# EAGLE design Apo Board 2017_PB (EAGLE 7.6.0)
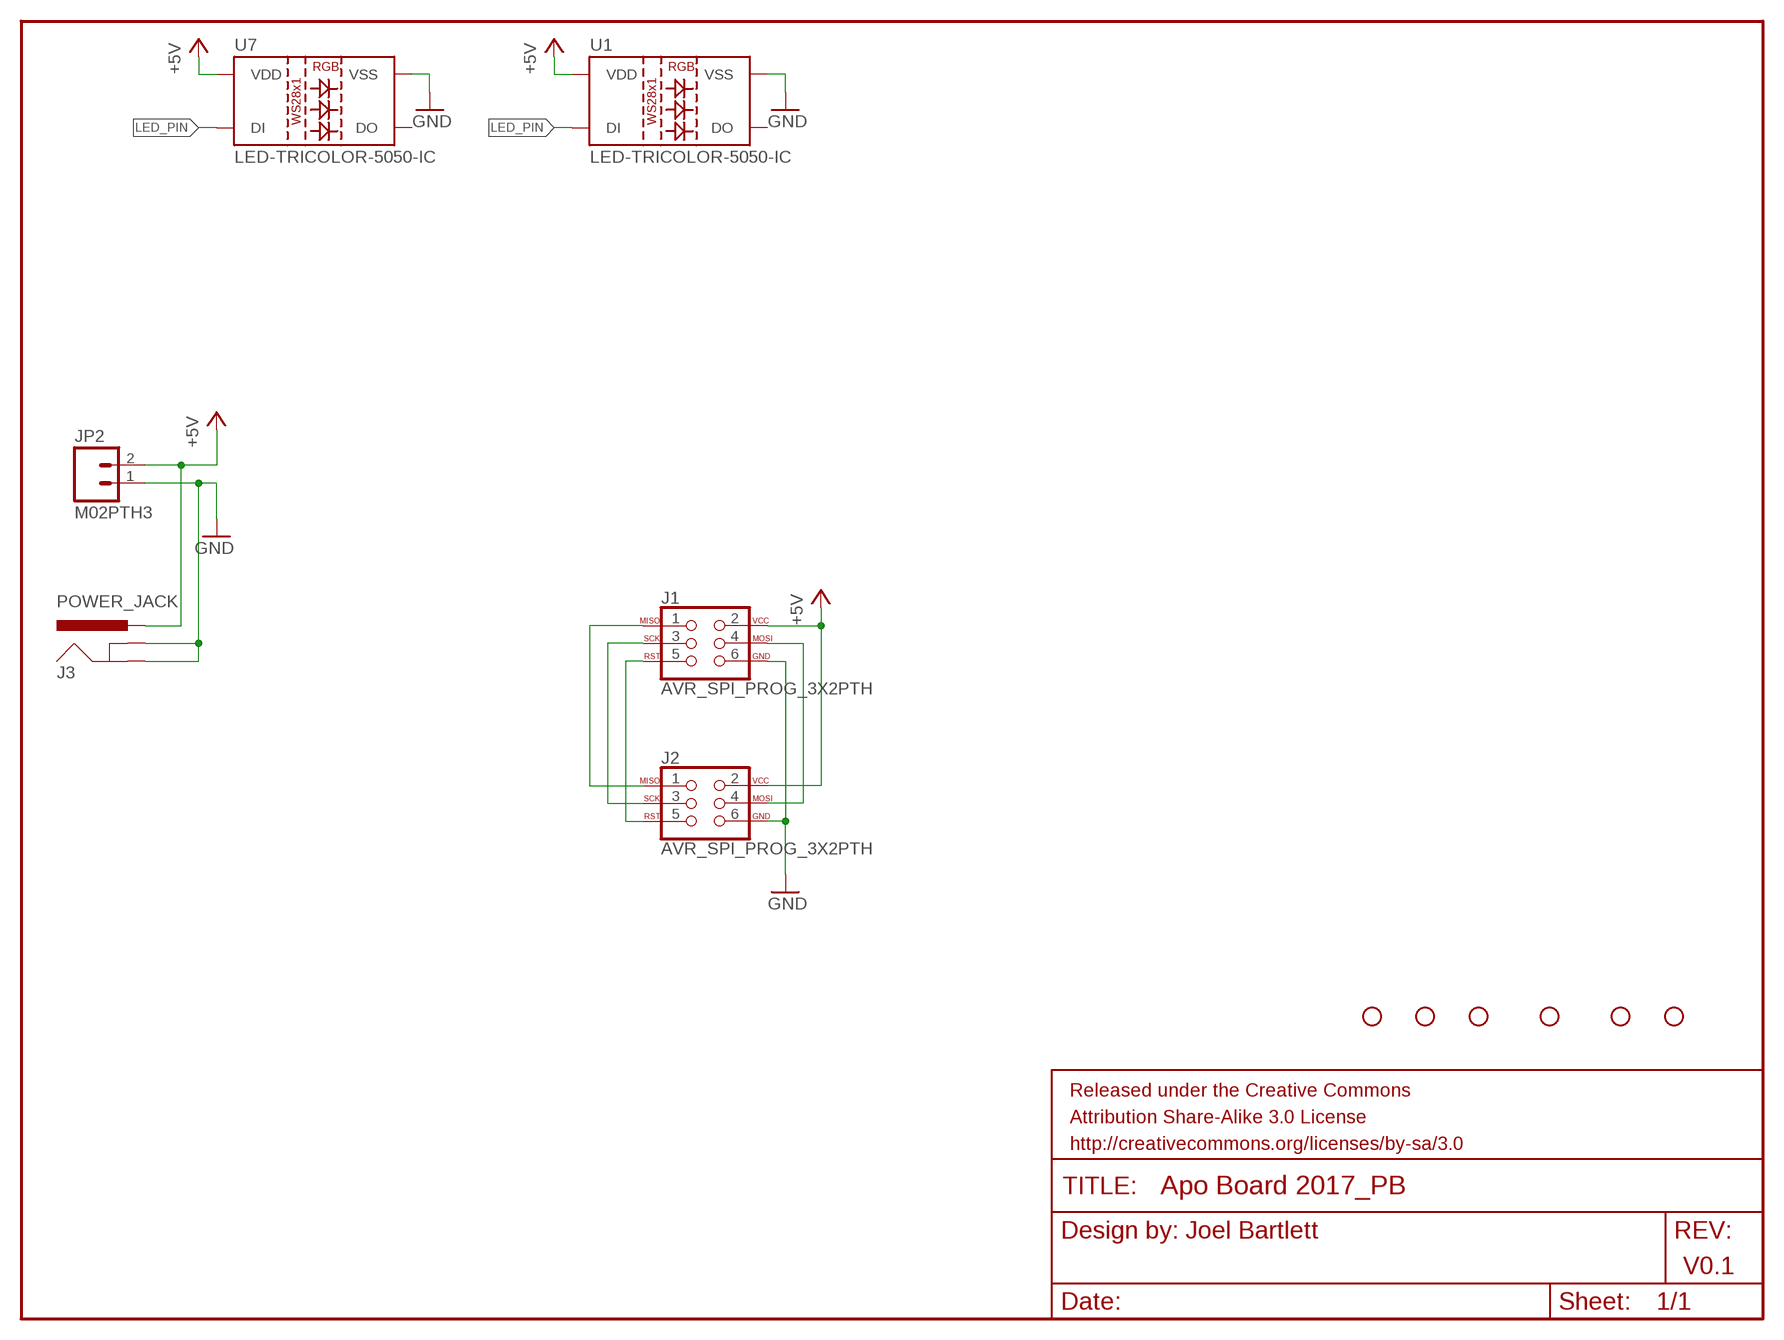
[diagram p0: schematic, sheet 1]

## Parts
FRAME1  FRAME-LETTER  [CREATIVE_COMMONS]
H1  STAND-OFF  [STAND-OFF]
H2  STAND-OFF  [STAND-OFF]
H3  STAND-OFF  [STAND-OFF]
H4  STAND-OFF  [STAND-OFF]
H5  STAND-OFF  [STAND-OFF]
H6  STAND-OFF  [STAND-OFF]
J1  AVR_SPI_PROG_3X2PTH  [2X3]
J2  AVR_SPI_PROG_3X2PTH  [2X3]
J3  POWER_JACK  [POWER_JACK_PTH]
JP2  M02PTH3  [1X02_LONGPADS]
U1  LED-TRICOLOR-5050-IC  [LED-RGB-THRU]
U7  LED-TRICOLOR-5050-IC  [LED-RGB-THRU]

## Nets
+5V: J1.2 J2.2 J3.PWR JP2.2 U1.2(VDD) U7.2(VDD)
GND: J1.6 J2.6 J3.GND J3.GNDBREAK JP2.1 U1.3(VSS) U7.3(VSS)
LED_PIN: U1.1(DI) U7.1(DI)
N$2: J1.4 J2.4
N$4: J1.5 J2.5
N$5: J1.3 J2.3
N$6: J1.1 J2.1
Unconnected: U1.4(DO) U7.4(DO)

## Notes on the sheet
- Joel Bartlett
- V0.1

## Library data of the parts
FRAME1 = SparkFun-Aesthetics:FRAME-LETTER: Schematic Frame Standard 8.5x11 US Letter frame
H1-H6 = SparkFun-Hardware:STAND-OFF: Stand Off Drill holes for mechanically mounting via screws, standoffs, etc. Note: Use the keepout ring to avoid running the screw head into surrounding components. Variant Overviews STAND-OFF - Mechanical footprint for a #4 phillips button head screw. STAND-OFF-TIGHT - Mechanical footprint for a #4 phillips button head screw, Example SparkFun Products Screw - Phillips Head (1/4", 4-40, 10 pack) <https://www.sparkfun.com/products/10453> (PRT-10453) Screw - Phillips Head (1/2", 4-40, 10 pack) <https://www.sparkfun.com/products/10452> (PRT-10452) Screw - Phillips Head (3/4", 4-40, 10 pack) <https://www.sparkfun.com/products/10451> (PRT-10451) Screw - Phillips Head (1", 4-40, 10 pack) <https://www.sparkfun.com/products/10450> (PRT-10450)
J1 J2 = SparkFun-Connectors:AVR_SPI_PROG_3X2: AVR ISP 6 Pin This is the reduced ISP connector for AVR programming. Common on Arduino. This footprint will take up less PCB space and can be used with a 10-pin to 6-pin adapter such as SKU: BOB-08508 **Special note about "TEST_POINT" package. The stop mask is on the top side, so if you want your programming test points to be on the bottom of your board, make sure to place this package on the bottom side of the board. This also ensure that the orientation to program from the bottom side will be correct. SparkFun Products: SparkFun ISP Pogo Adapter <https://www.sparkfun.com/products/11591> - NS Tiny AVR Programmer <https://www.sparkfun.com/products/11801> -PTH
J3 = SparkFun-Connectors:POWER_JACK: Power Jack Connector This is the standard 5.5mm barrel jack for power. The PTH is the most common, proven, reliable, footprint. The Slot footprint only works if the mill layer is transmitted to the PCB fab house so be warned. Here are the connectors we sell at SparkFun: DC Barrel Power Jack/Connector <https://www.sparkfun.com/products/119> (PRT-00119) DC Barrel Power Jack/Connector (SMD) <https://www.sparkfun.com/products/12748> (PRT-12748) DC Barrel Jack Adapter - Breadboard Compatible <https://www.sparkfun.com/products/10811> (PRT-10811) It is used on this SparkFun product (and many, many others): SparkFun RedBoard - Programmed with Arduino <https://www.sparkfun.com/products/12757> (DEV-12757) Also, if you need a mating power supply or connector, please check these out: Wall Adapter Power Supply - 9VDC 650mA <https://www.sparkfun.com/products/298> (TOL-00298) DC Barrel Jack Adapter - Male <https://www.sparkfun.com/products/10287> (PRT-10287); PROD_ID: CONN-08197
JP2 = SparkFun-Connectors:M02: Standard 2-pin 0.1" header. Use with - straight break away headers ( PRT-00116) - right angle break away headers (PRT-00553) - swiss pins (PRT-00743) - machine pins (PRT-00117) - female headers (PRT-00115) Molex polarized connector foot print use with: PRT-08233 with associated crimp pins and housings. 2.54_SCREWTERM for use with PRT-10571. 3.5mm Screw Terminal footprints for PRT-08084 5mm Screw Terminal footprints for use with PRT-08433
U1 U7 = SparkFun-LED:LED-TRICOLOR-5050-IC: WS2811 RGB LED w/driver 5x5mm SMD LED with built-in controller IC. DIO-11598

## Net classes
0 default: width 0.152 mm, drill 0.305 mm, clearance 0.152 mm
1 vcc: width 0.254 mm
3 ButtonSignal: width 0.254 mm

## Board
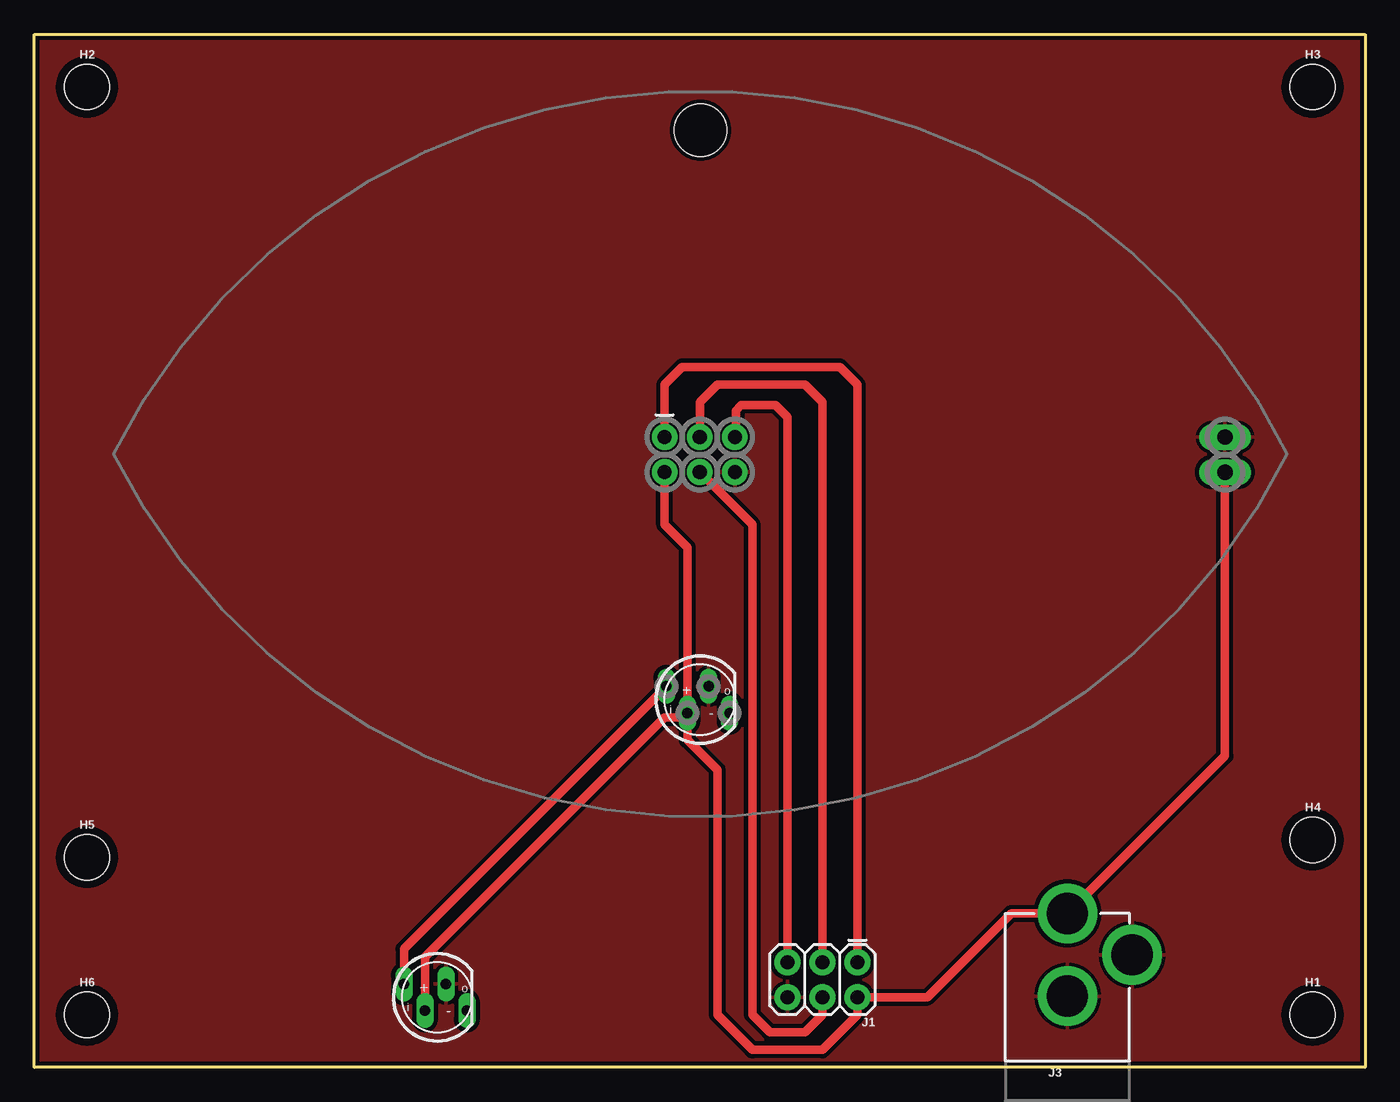
[diagram p1: board, top side]
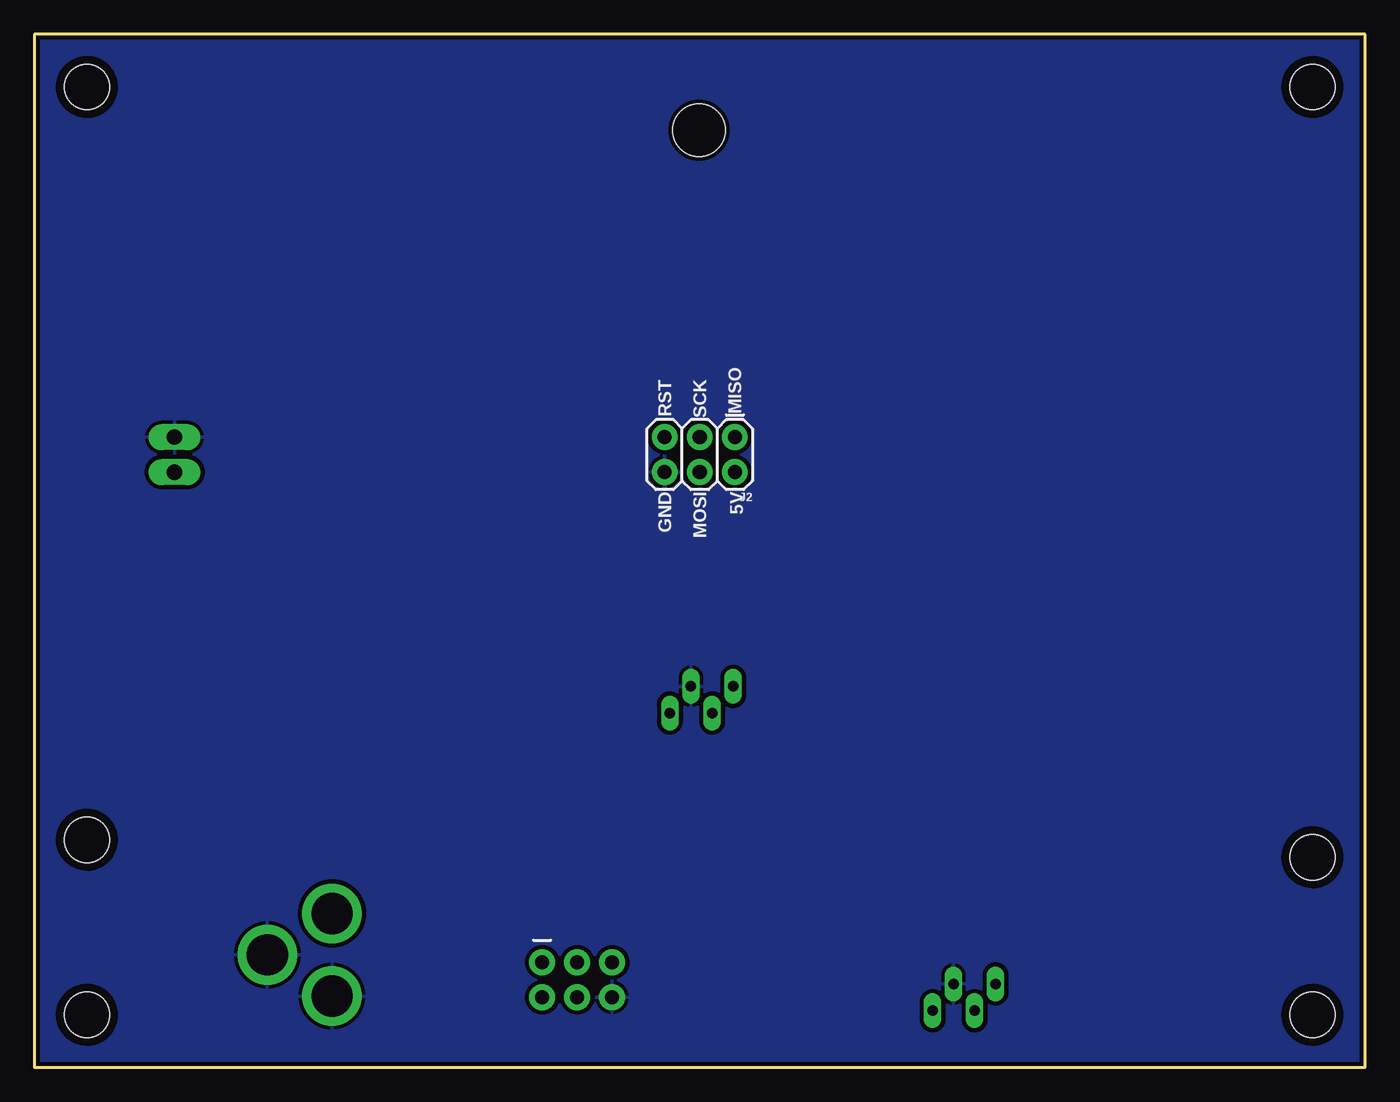
[diagram p2: board, bottom side, seen from below]

Size 96.52 x 74.93 mm. Coordinates in mm from the lower left corner, seen from the top.
Outline: 0,74.93 96.52,74.93 96.52,0 0,0 0,74.93
Copper layers (1*16): Top 0.035mm / dielectric 1.5mm / Bottom 0.035mm
Design rules "SparkFun-2-layer-TIGHT": minimum track width 7mil, minimum drill 15mil, track to track 7mil, track to pad 7mil, pad to pad 7mil, via to via 7mil, smd to smd 7mil, copper to edge 7mil, drill to drill 7mil, minimum pad ring 7mil, minimum via ring 7mil, stop-mask expansion 4mil, vias tented up to drill 25mil, thermal gap 10mil
Holes 3.81 mm at 48.31,68

### Footprints (pad centres in the part's own frame; a part is rotated, then mirrored left to right if it is on the bottom)
STAND-OFF = hole 3.302: 0,0
2X3 = drill 1.016 pad 1.88: 1 0,0; 2 0,2.54; 3 2.54,0; 4 2.54,2.54; 5 5.08,0; 6 5.08,2.54
POWER_JACK_PTH = drill 2.997 pad 4.318: GND 0,7.7; GNDBREAK 4.7,10.7; PWR 0,13.7
1X02_LONGPADS = drill 1.118 pad 1.88 long: 1 0,0; 2 2.54,0
LED-RGB-THRU = drill 0.762 pad 1.27 long: 1 2.413,-0.968; 2 0.889,0.968; 3 -0.635,-0.968; 4 -2.159,0.968

### Placement (x,y rotation side)
FRAME1  26.44,4.75 0 top
H1  92.71,3.81 0 top
H2  3.81,71.12 0 top
H3  92.71,71.12 0 top
H4  92.71,16.51 0 top
H5  3.81,15.24 0 top
H6  3.81,3.81 0 top
J1  59.69,7.62 180 top
J2  45.72,45.72 180 bottom
J3  74.93,-2.54 0 top
JP2  86.36,45.72 270 top
U1  29.21,5.08 180 top
U7  48.26,26.67 180 top

### Tracks (layer width: path | path; a pad name or v marks a point on that pad's centre or on a via)
+5V
  Top 0.61: U1.2 28.32,8 45.72,25.4 47.07,25.4 U7.2 | U7.2 47.37,37.72 45.72,39.37 J2.2 | U7.2 47.37,23.75 49.53,21.59 49.53,3.81 52.07,1.27 57.15,1.27 59.69,3.81 J1.2 64.77,5.08 70.85,11.16 J3.PWR 86.36,22.59 JP2.2
GND
  pour Bottom (isolate 0.305): 0,74.93 96.52,74.93 96.52,0 0,0
  pour Top (isolate 0.305): 0,74.93 96.52,74.93 96.52,0 0,0
LED_PIN
  Top 0.61: U7.1 26.8,8.59 U1.1
N$2
  Top 0.61: J1.4 57.15,3.81 55.88,2.54 53.34,2.54 52.07,3.81 52.07,39.37 J2.4
N$4
  Top 0.61: J1.5 54.61,47.17 53.75,48.03 51.26,48.03 50.88,47.65 50.88,45.8 J2.5
N$5
  Top 0.61: J1.3 57.15,48.26 55.88,49.53 49.53,49.53 48.26,48.26 J2.3
N$6
  Top 0.61: J1.1 59.69,49.53 58.42,50.8 46.99,50.8 45.72,49.53 J2.1

### Text on the board
bPlace: MISO | SCK | RST | 5V | MOSI | GND
tValues: Joel Bartlett
tDocu: BLK- | RED+